# Altium schematic sheet Headstage_withFPGA.SchDoc
size E
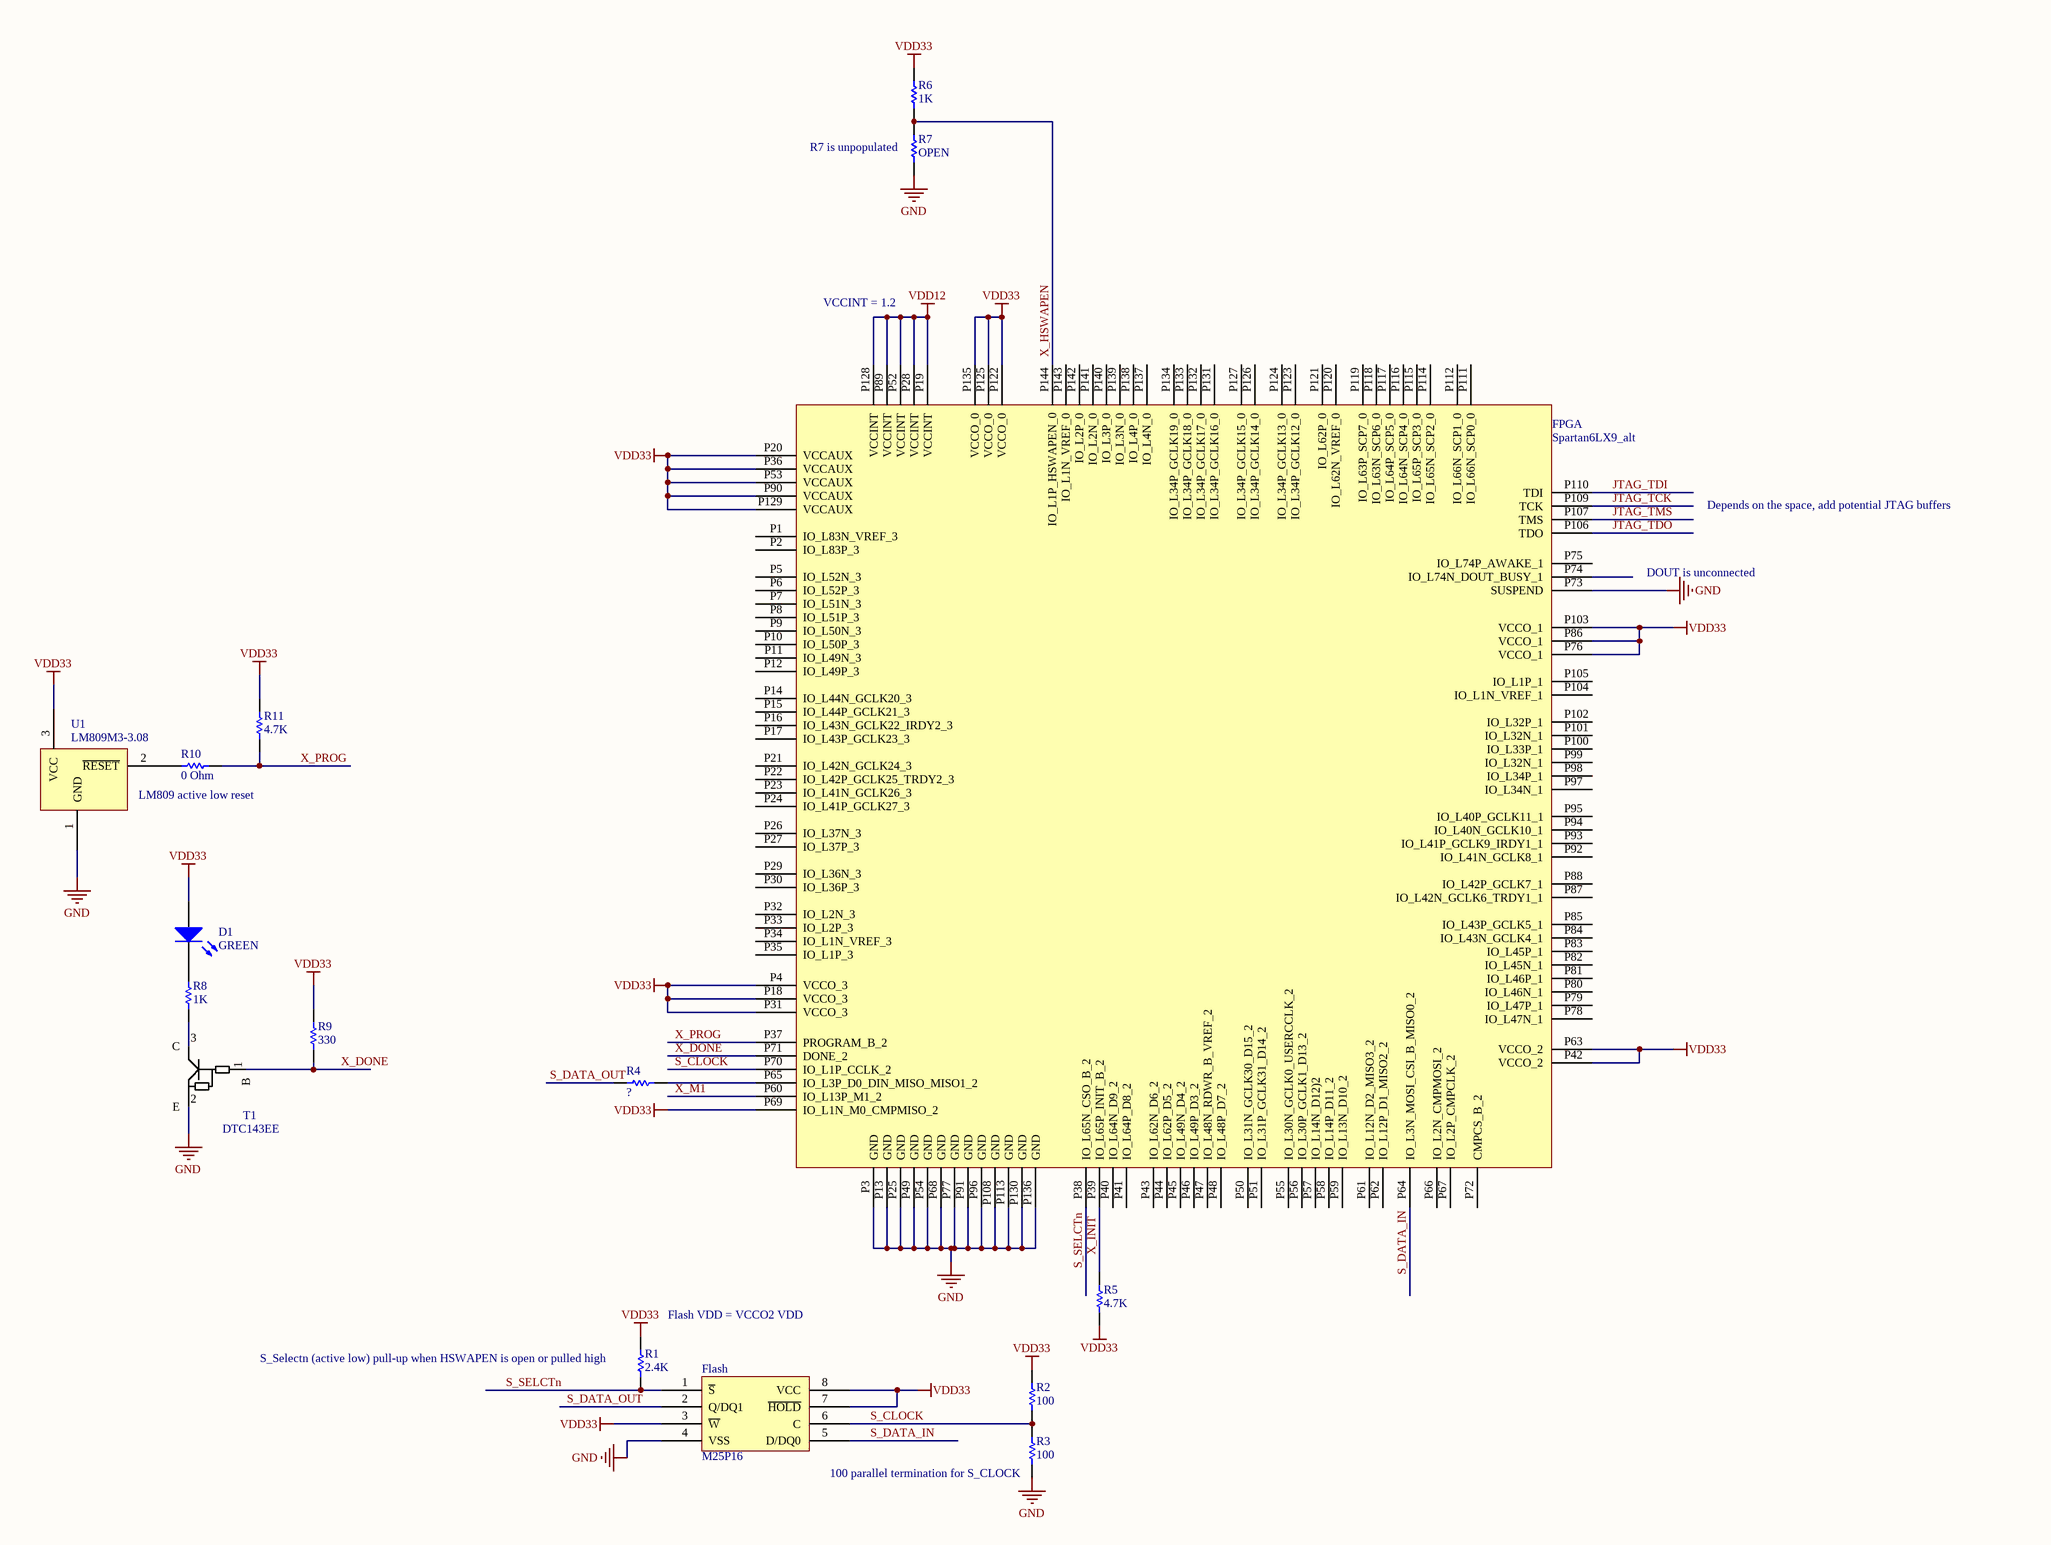
[diagram p0: Headstage_withFPGA.SchDoc]

## Parts
D1  GREEN
Flash  M25P16
FPGA  Spartan6LX9_alt
R1  value 2.4K  [AXIAL-0.3]  (hidden comment: Res1)
R2  value 100  [AXIAL-0.3]  (hidden comment: Res1)
R3  value 100  [AXIAL-0.3]  (hidden comment: Res1)
R4  Res1  [AXIAL-0.3]  (value not drawn)
R5  value 4.7K  [AXIAL-0.3]  (hidden comment: Res1)
R6  value 1K  [AXIAL-0.3]  (hidden comment: Res1)
R7  value OPEN  [AXIAL-0.3]  (hidden comment: Res1)
R8  value 1K  [AXIAL-0.3]  (hidden comment: Res1)
R9  value 330  [AXIAL-0.3]  (hidden comment: Res1)
R10  value 0 Ohm  [AXIAL-0.3]  (hidden comment: Res1)
R11  value 4.7K  [AXIAL-0.3]  (hidden comment: Res1)
T1  DTC143EE
U1  LM809M3-3.08

## Nets
GND: Flash.4(VSS) FPGA.P3(GND) FPGA.P13(GND) FPGA.P25(GND) FPGA.P49(GND) FPGA.P54(GND) FPGA.P68(GND) FPGA.P73(SUSPEND) FPGA.P77(GND) FPGA.P91(GND) FPGA.P96(GND) FPGA.P108(GND) FPGA.P113(GND) FPGA.P130(GND) FPGA.P136(GND) R3.1 R7.1 T1.2(E) U1.1(GND)
VDD12: FPGA.P19(VCCINT) FPGA.P28(VCCINT) FPGA.P52(VCCINT) FPGA.P89(VCCINT) FPGA.P128(VCCINT)
VDD33: D1.1(A) Flash.3(~{W}) Flash.7(~{HOLD}) Flash.8(VCC) FPGA.P4(VCCO_3) FPGA.P18(VCCO_3) FPGA.P20(VCCAUX) FPGA.P31(VCCO_3) FPGA.P36(VCCAUX) FPGA.P42(VCCO_2) FPGA.P53(VCCAUX) FPGA.P63(VCCO_2) FPGA.P69(IO_L1N_M0_CMPMISO_2) FPGA.P76(VCCO_1) FPGA.P86(VCCO_1) FPGA.P90(VCCAUX) FPGA.P103(VCCO_1) FPGA.P122(VCCO_0) FPGA.P125(VCCO_0) FPGA.P129(VCCAUX) FPGA.P135(VCCO_0) R1.2 R2.2 R5.1 R6.2 R9.2 R11.1 U1.3(VCC)
JTAG_TCK: FPGA.P109(TCK)
JTAG_TDI: FPGA.P110(TDI)
JTAG_TDO: FPGA.P106(TDO)
JTAG_TMS: FPGA.P107(TMS)
S_CLOCK: Flash.6(C) FPGA.P70(IO_L1P_CCLK_2) R2.1 R3.2
S_DATA_IN: Flash.5(D/DQ0) FPGA.P64(IO_L3N_MOSI_CSI_B_MISO0_2)
S_DATA_OUT: Flash.2(Q/DQ1) R4.2
S_SELCTn: Flash.1(~{S}) FPGA.P38(IO_L65N_CSO_B_2) R1.1
X_DONE: FPGA.P71(DONE_2) R9.1 T1.1(B)
X_HSWAPEN: FPGA.P144(IO_L1P_HSWAPEN_0) R6.1 R7.2
X_INIT: FPGA.P39(IO_L65P_INIT_B_2) R5.2
X_M1: FPGA.P60(IO_L13P_M1_2)
X_PROG: FPGA.P37(PROGRAM_B_2) R10.1 R11.2
NetD1_2: D1.2(K) R8.2
NetFPGA_P65: FPGA.P65(IO_L3P_D0_DIN_MISO_MISO1_2) R4.1
NetR8_1: R8.1 T1.3(C)
NetR10_2: R10.2 U1.2(~{RESET})

Not connected (* = marked no-connect by the designer): FPGA P1(IO_L83N_VREF_3) P2(IO_L83P_3) P5(IO_L52N_3) P6(IO_L52P_3) P7(IO_L51N_3) P8(IO_L51P_3) P9(IO_L50N_3) P10(IO_L50P_3) P11(IO_L49N_3) P12(IO_L49P_3) P14(IO_L44N_GCLK20_3) P15(IO_L44P_GCLK21_3) P16(IO_L43N_GCLK22_IRDY2_3) P17(IO_L43P_GCLK23_3) P21(IO_L42N_GCLK24_3) P22(IO_L42P_GCLK25_TRDY2_3) P23(IO_L41N_GCLK26_3) P24(IO_L41P_GCLK27_3) P26(IO_L37N_3) P27(IO_L37P_3) P29(IO_L36N_3) P30(IO_L36P_3) P32(IO_L2N_3) P33(IO_L2P_3) P34(IO_L1N_VREF_3) P35(IO_L1P_3) P40(IO_L64N_D9_2) P41(IO_L64P_D8_2) P43(IO_L62N_D6_2) P44(IO_L62P_D5_2) P45(IO_L49N_D4_2) P46(IO_L49P_D3_2) P47(IO_L48N_RDWR_B_VREF_2) P48(IO_L48P_D7_2) P50(IO_L31N_GCLK30_D15_2) P51(IO_L31P_GCLK31_D14_2) P55(IO_L30N_GCLK0_USERCCLK_2) P56(IO_L30P_GCLK1_D13_2) P57(IO_L14N_D12)2) P58(IO_L14P_D11_2) P59(IO_L13N_D10_2) P61(IO_L12N_D2_MISO3_2) P62(IO_L12P_D1_MISO2_2) P66(IO_L2N_CMPMOSI_2) P67(IO_L2P_CMPCLK_2) P72(CMPCS_B_2) P74(IO_L74N_DOUT_BUSY_1) P75(IO_L74P_AWAKE_1) P78(IO_L47N_1) P79(IO_L47P_1) P80(IO_L46N_1) P81(IO_L46P_1) P82(IO_L45N_1) P83(IO_L45P_1) P84(IO_L43N_GCLK4_1) P85(IO_L43P_GCLK5_1) P87(IO_L42N_GCLK6_TRDY1_1) P88(IO_L42P_GCLK7_1) P92(IO_L41N_GCLK8_1) P93(IO_L41P_GCLK9_IRDY1_1) P94(IO_L40N_GCLK10_1) P95(IO_L40P_GCLK11_1) P97(IO_L34N_1) P98(IO_L34P_1) P99(IO_L32N_1) P100(IO_L33P_1) P101(IO_L32N_1) P102(IO_L32P_1) P104(IO_L1N_VREF_1) P105(IO_L1P_1) P111(IO_L66N_SCP0_0) P112(IO_L66N_SCP1_0) P114(IO_L65N_SCP2_0) P115(IO_L65P_SCP3_0) P116(IO_L64N_SCP4_0) P117(IO_L64P_SCP5_0) P118(IO_L63N_SCP6_0) P119(IO_L63P_SCP7_0) P120(IO_L62N_VREF_0) P121(IO_L62P_0) P123(IO_L34P_GCLK12_0) P124(IO_L34P_GCLK13_0) P126(IO_L34P_GCLK14_0) P127(IO_L34P_GCLK15_0) P131(IO_L34P_GCLK16_0) P132(IO_L34P_GCLK17_0) P133(IO_L34P_GCLK18_0) P134(IO_L34P_GCLK19_0) P137(IO_L4N_0) P138(IO_L4P_0) P139(IO_L3N_0) P140(IO_L3P_0) P141(IO_L2N_0) P142(IO_L2P_0) P143(IO_L1N_VREF_0)

## Notes on the sheet
- (near R7) R7 is unpopulated
- VCCINT = 1.2
- Depends on the space, add potential JTAG buffers
- DOUT is unconnected
- (near U1) LM809 active low reset
- (near R1) Flash VDD = VCCO2 VDD
- (near R1) S_Selectn (active low) pull-up when HSWAPEN is open or pulled high
- (near R3) 100 parallel termination for S_CLOCK

## Library data of the parts
D1 = LED3: Typical BLUE SiC LED; Published: 8-Jun-2000; LatestRevisionDate: 17-Dec-2003; LatestRevisionNote: PCB Footprint replaced.; DatasheetVersion: 16-Apr-2002; PackageVersion: 16-Apr-2002; PackageReference: 3.5X2.8X1.9; Publisher: Altium Limited; PackageDescription: SM LED; 2 C-Bend Leads; Body 3.5 x 2.8 x 1.9 mm, inc leads (LxWxH typ)
R1-R11 = Res1: Resistor; Published: 8-Jun-2000; LatestRevisionDate: 17-Jul-2002; LatestRevisionNote: Re-released for DXP Platform.; PackageReference: AXIAL-0.3; Publisher: Altium Limited; PackageDescription: Axial Device, Thru-Hole; 2 Leads; 0.3 in Pin Spacing
  R4: Value: ?